# Altium schematic sheet usb_to_uart.SchDoc
size A4; SheetNumber: 5; SheetTotal: 6
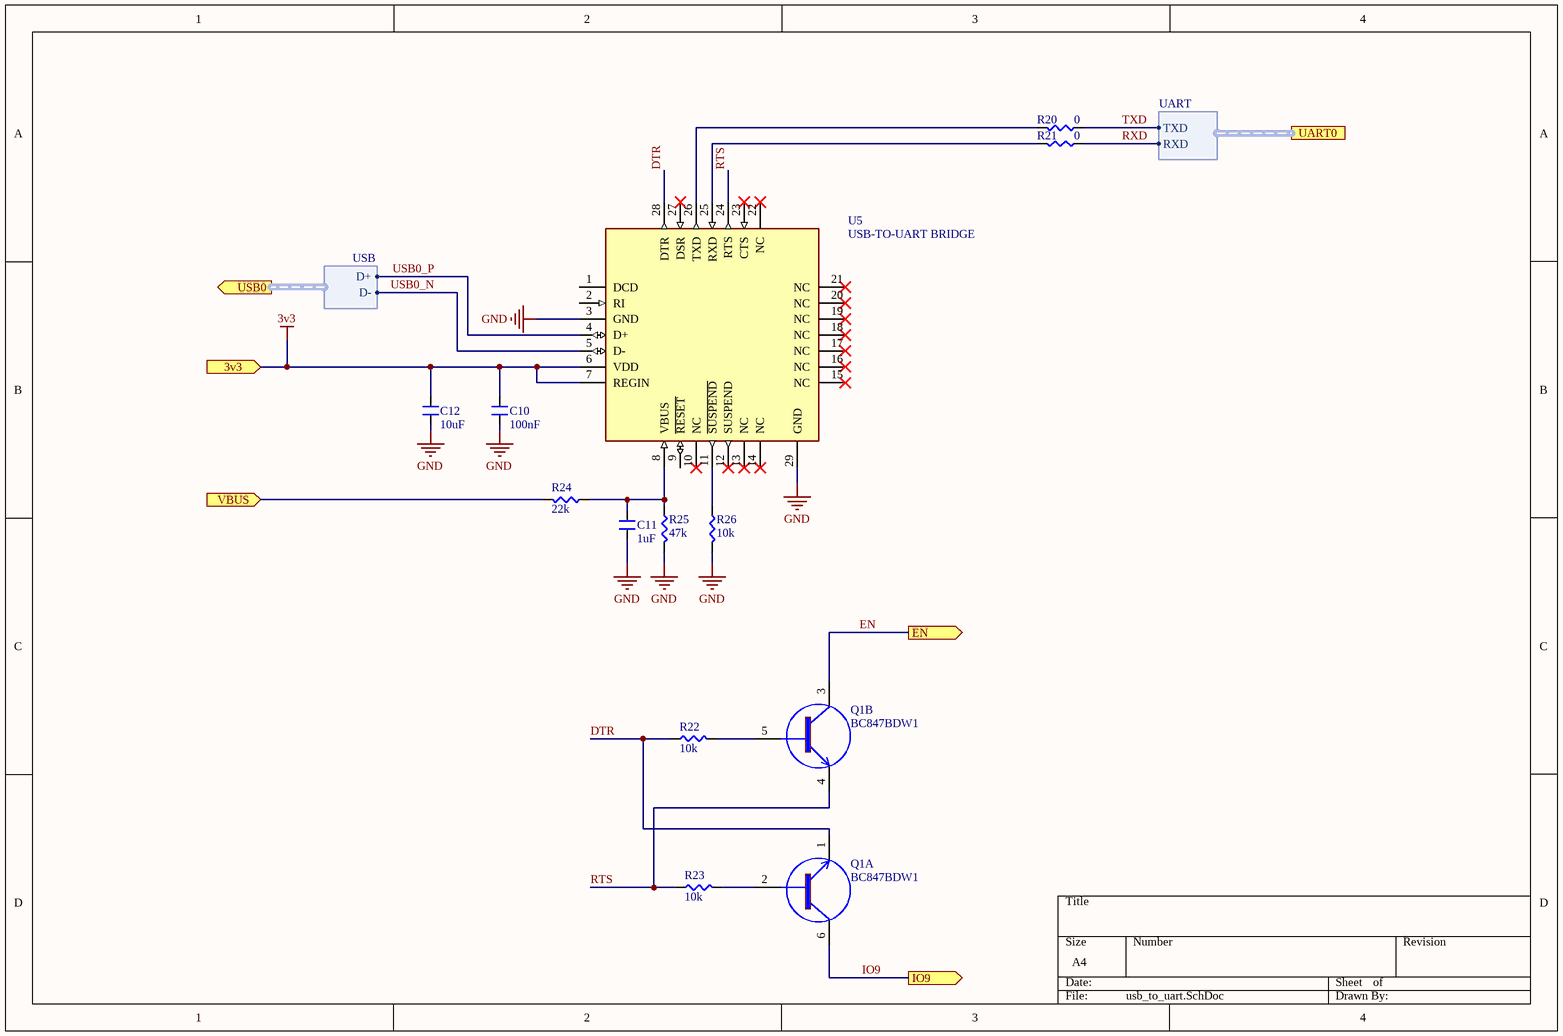
[diagram p0: usb_to_uart.SchDoc]

## Parts
C10  100nF  [CAP0603]
C11  1uF  [CAP1206_38MIL]
C12  10uF  [CAP1206_63MIL]
Q1  BC847BDW1  [SOT-363]  (parts A,B of 2)
R20  0  [RES0603]
R21  0  [RES0603]
R22  10k  [RES0603]
R23  10k  [RES0603]
R24  22k  [RES0603]
R25  47k  [RES0603]
R26  10k  [RES0603]
U5  USB-TO-UART BRIDGE  [QFN50P480X480X80_HS-29N]

## Ports
3v3 (in), EN (out), IO9 (out), UART0 (harness UART), USB0 (out, harness USB), VBUS (in)

## Harnesses
UART: TXD, RXD
USB: D-, D+

## Nets
3v3: C10.2 C12.2 U5.6(VDD) U5.7(REGIN) ; port 3v3
GND: C10.1 C11.1 C12.1 R25.1 R26.1 U5.3(GND) U5.29(GND)
DTR: Q1.1(E2) R22.2 U5.28(DTR)
EN: Q1.3(C2) ; port EN
IO9: Q1.6(C2) ; port IO9
RTS: Q1.4(E2) R23.2 U5.24(RTS)
RXD: R21.2 ; port UART0.RXD
TXD: R20.2 ; port UART0.TXD
USB0_N: U5.5(D-) ; port USB0.D-
USB0_P: U5.4(D+) ; port USB0.D+
VBUS: R24.1 ; port VBUS
NetC11_2: C11.2 R24.2 R25.2 U5.8(VBUS)
NetQ1_2: Q1.2(B2) R23.1
NetQ1_5: Q1.5(B2) R22.1
NetR20_1: R20.1 U5.26(TXD)
NetR21_1: R21.1 U5.25(RXD)
NetR26_2: R26.2 U5.11(~{SUSPEND})

Not connected (* = marked no-connect by the designer): U5 1(DCD) 2(RI) 9(~{RESET}) 10(NC)* 12(SUSPEND)* 13(NC)* 14(NC)* 15(NC)* 16(NC)* 17(NC)* 18(NC)* 19(NC)* 20(NC)* 21(NC)* 22(NC)* 23(CTS)* 27(DSR)*

## Library data of the parts
C10 = GCM188R71H104KA57J: Tolerance ±10% / Rated Voltage 50Vdc / Temperature 0±30ppm/℃; Manufacturer: Arrow Electronics; Item: 100nF 50V  ±10%; Vdc: 50V; Part Number: GCM188R71H104KA57J; Supplier 1: Mouser; Supplier Part Number 1: 81-GCM188R71H104KA7J; Case: 0603; Tolerance: 10%; Value: 100nF; HelpURL: http://www.farnell.com/datasheets/4360.pdf?src-supplier=Element14; Category: Multilayer Ceramic Capacitors - SMD/SMT
C11 = C1206X105K5RECAUTO: Tolerance ±10% / Rated Voltage 50Vdc / Dielectric:  X7R; Manufacturer: KEMET; Item: 1uF 50V ±10%; Vdc: 50V; Tolerance: 0,1; Part Number: C1206X105K5RECAUTO; Supplier 1: Mouser; Case: 1206; Value: 1uF; HelpURL: https://eu.mouser.com/datasheet/2/212/1/KEM_C1090_X7R_ESD-1103328.pdf
C12 = GRT31CR61H106ME01L: Tolerance ±20% / Voltage - Rated 50V; Manufacturer: Murata; Item: 10uF 50V ±20%; Tolerance: 0,2; Part Number: GRT31CR61H106ME01L; Supplier 1: Mouser; Supplier Part Number 1: 81-GRT31CR61H106ME1L; Case: 1206; Vdc: 50V; Value: 10uF; HelpURL: https://eu.mouser.com/datasheet/2/281/GRT31CR61H106ME01-01-1065064.pdf; Category: Multilayer Ceramic Capacitors - SMD/SMT
Q1 = BC847BDW1: 45V 380mW 200@2mA,5V 100mA NPN SOT-363 Bipolar Transistors - BJT ROHS; Manufacturer: onsemi; Vds: 45B; Part Number: BC847BDW1; Item: BC847BDW1; Supplier 1: LCSC; Supplier Part Number 1: C513269; Channel: NPN; Case: SOT-363; HelpURL: https://www.lcsc.com/datasheet/lcsc_datasheet_2004241034_onsemi-BC847BDW1T3G_C513269.pdf; Category: Transistors/Thyristors/Darlington Transistor Arrays
R20 R21 = AF0603JR-070RL: Tolerance ±1% / Power (Watts) 0.1W, 1/10W / Temperature Coefficient ±100ppm/°C; Manufacturer: YAGEO; Item: 0 ±1% 0.1W; Part Number: AF0603JR-070RL; Supplier 1: Mouser; Supplier Part Number 1: 603-AF0603JR-070RL; Case: 0603; Tolerance: 1%; Value: 0; HelpURL: https://eu.mouser.com/datasheet/2/447/PYu_AF_51_RoHS_L_8-3003045.pdf; Category: Thin Film Resistors - SMD
R22 R23 R26 = CR0603-FX-1002ELF: Tolerance ±1% / Power (Watts) 0.1W, 1/10W / Temperature Coefficient ±100ppm/°C; Manufacturer: Bourns; Item: 10k  ±1% 0.1W; Part Number: CR0603-FX-1002ELF; Supplier 1: Mouser; Supplier Part Number 1: 652-CR0603FX-1002ELF; Case: 0603; Tolerance: 1%; Value: 10k; HelpURL: https://eu.mouser.com/datasheet/2/54/cr-1858361.pdf; Category: Thin Film Resistors - SMD
R24 = CR0603-FX-2202ELF: Tolerance ±1% / Power (Watts) 0.1W, 1/10W / Temperature Coefficient ±100ppm/°C; Manufacturer: Bourns; Item: 22k ±1% 0.1W; Part Number: CR0603-FX-2202ELF; Supplier 1: Mouser; Supplier Part Number 1: 652-CR0603FX-2202ELF; Case: 0603; Tolerance: 1%; Value: 22k; HelpURL: https://www.mouser.com/datasheet/2/54/cr-1858361.pdf; Category: Thin Film Resistors - SMD
R25 = ERJ-3EKF4702V: Tolerance ±1% / Power (Watts) 0.1W, 1/10W / Temperature Coefficient ±100ppm/°C; Manufacturer: Panasonic; Item: 47k ±1% 0.1W; Part Number: ERJ-3EKF4702V; Supplier 1: Mouser; Supplier Part Number 1: 667-ERJ-3EKF4702V; Case: 0603; Tolerance: 1%; Value: 47k; HelpURL: https://www.mouser.com/datasheet/2/315/AOA0000C304-1149620.pdf; Category: Thin Film Resistors - SMD
U5 = CP2102: Voltage - Supply 3V ~ 3.6V / Current - Supply 20mA / Standards USB 2.0; Manufacturer: Silicon Lab; Part Number: CP2102; Supplier 1: Digi-Key; Supplier Part Number 1: 336-1160-1-ND; Case: QFN-28; Item: CP2102; HelpURL: https://www.silabs.com/documents/public/errata/CP2102Berrata.pdf?src-supplier=Digi-Key; Category: USB to UART Interface IC